# EAGLE design nucleum (EAGLE 6.5.0)
AUTHOR: Joshua Adkins; REV: A; TITLE: Nucleum

## Sheet 1 of 2
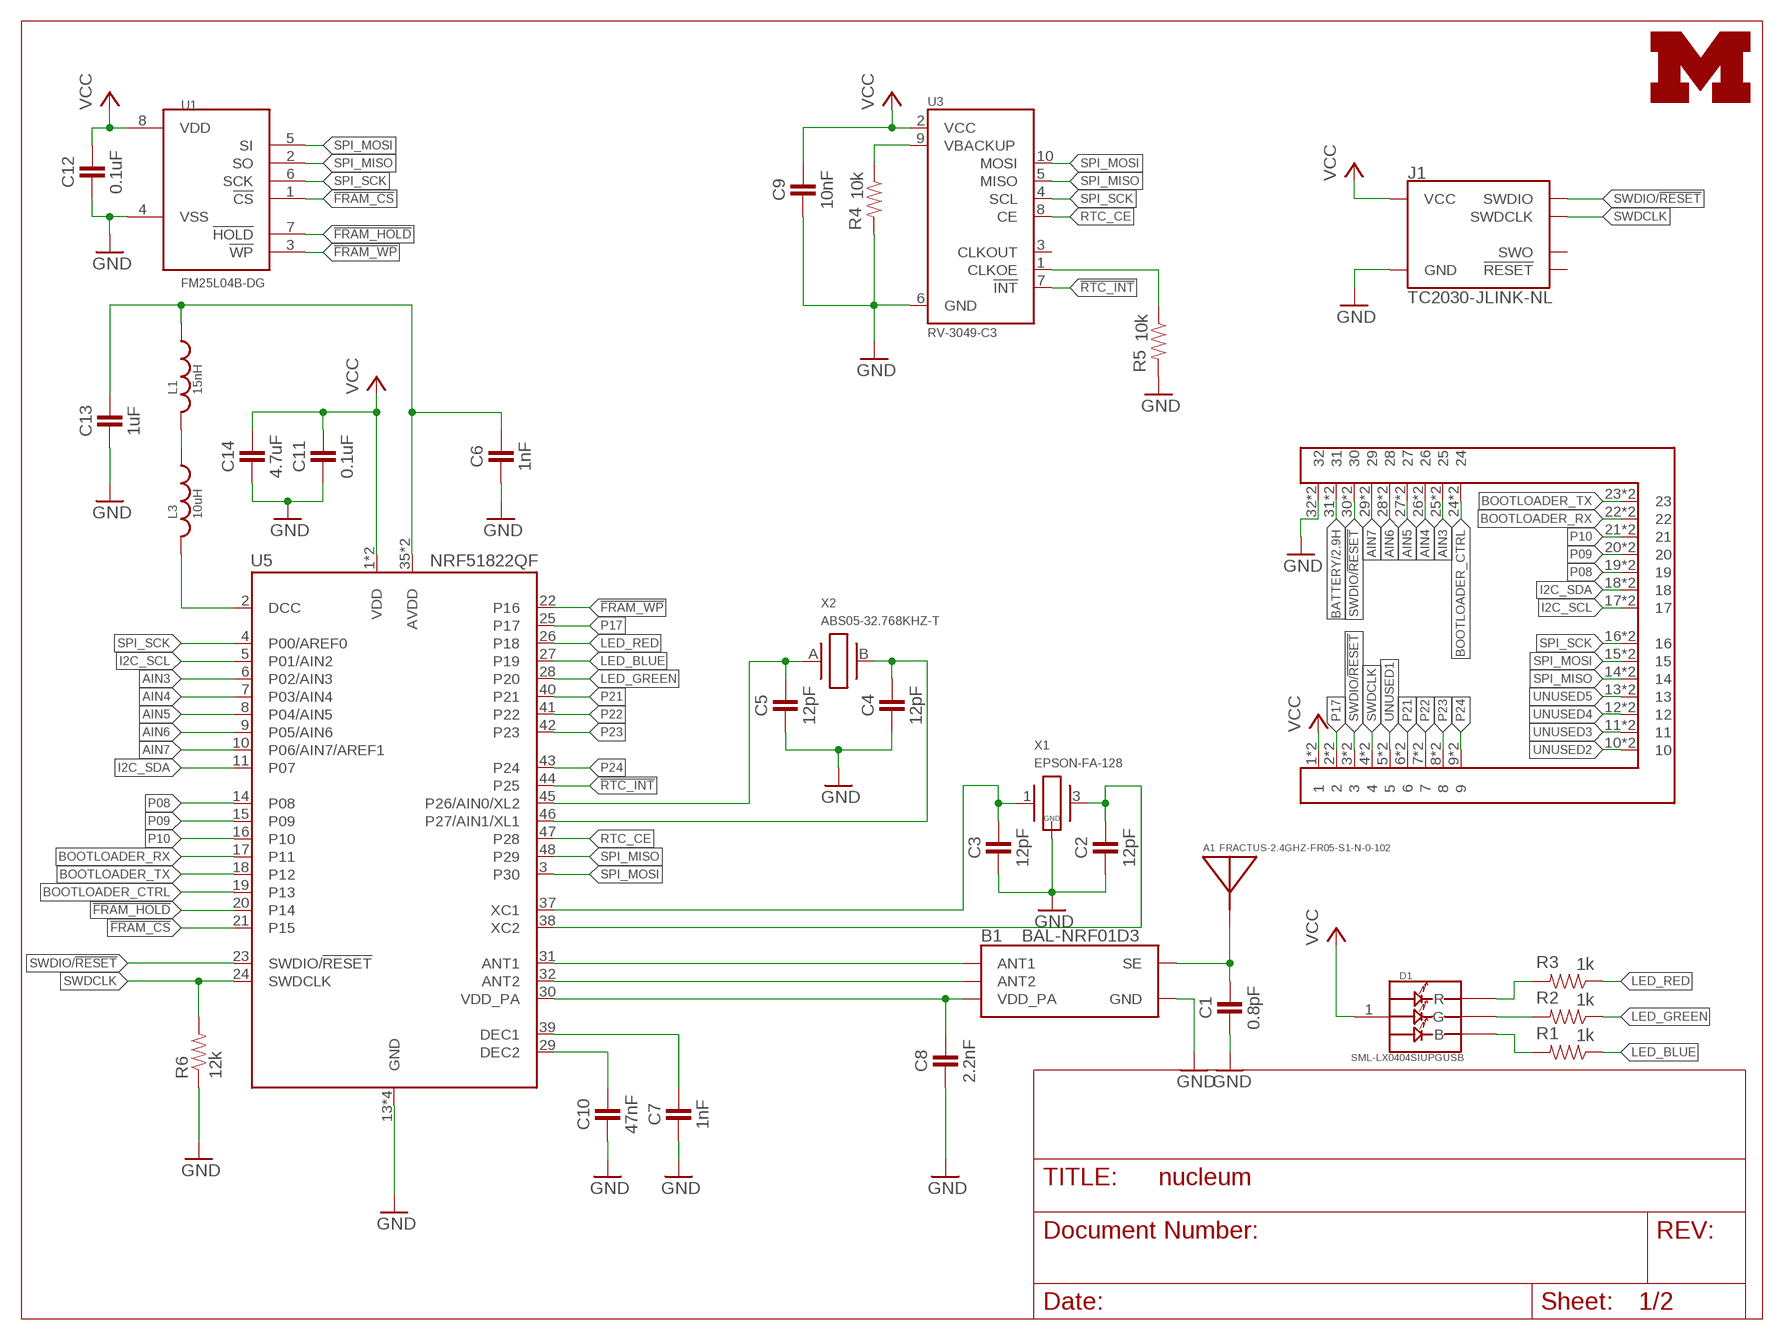
[diagram p0: schematic, sheet 1]

### Parts
A1  FRACTUS-2.4GHZ-FR05-S1-N-0-102  [FRACTUS-ANTENNA-FR05-S1-N-0-102]
B1  BAL-NRF01D3  [BAL-NRF01D3]
C1  0.8pF  CAPACITOR  [0402_CAP]
C2  12pF  CAPACITOR  [0402_CAP]
C3  12pF  CAPACITOR  [0402_CAP]
C4  12pF  CAPACITOR  [0402_CAP]
C5  12pF  CAPACITOR  [0402_CAP]
C6  1nF  CAPACITOR  [0402_CAP]
C7  1nF  CAPACITOR  [0402_CAP]
C8  2.2nF  CAPACITOR  [0402_CAP]
C9  10nF  CAPACITOR  [0402_CAP]
C10  47nF  CAPACITOR  [0402_CAP]
C11  0.1uF  CAPACITOR  [0402_CAP]
C12  0.1uF  CAPACITOR  [0402_CAP]
C13  1uF  CAPACITOR  [0402_CAP]
C14  4.7uF  CAPACITOR  [0402_CAP]
D1  SML-LX0404SIUPGUSB  [1MM_SQ_4PAD]
J1  TC2030-JLINK-NL  [TC2030-IDC-NL]
J3  ATUM-HEADER  [ATUM-HEADER]
L1  15nH  INDUCTOR0402  [0402_CAP]
L3  10uH  INDUCTOR0603  [0603_CAP]
LOGO1  UMICH_SOLID_TINY  [UMICH_SOLID_50MIL]
R1  1k  RESISTOR0402_RES  [0402_RES]
R2  1k  RESISTOR0402_RES  [0402_RES]
R3  1k  RESISTOR0402_RES  [0402_RES]
R4  10k  RESISTOR0402_RES  [0402_RES]
R5  10k  RESISTOR0402_RES  [0402_RES]
R6  12k  RESISTOR0402_RES  [0402_RES]
U1  FM25L04B-DG  [TDFN-8]
U3  RV-3049-C3  [MICRO-CRYSTAL-C3]
U5  NRF51822QF  [QFN-48-6MM]
X1  EPSON-FA-128  [FA-128]
X2  ABS05-32.768KHZ-T  [ABS05]

### Nets
!FRAM_CS: U1.1(!CS) U5.21(P15)
!FRAM_HOLD: U1.7(!HOLD) U5.20(P14)
!FRAM_WP: U1.3(!WP) U5.22(P16)
!RTC_INT: U3.7(!INT) U5.44(P25)
AIN3: J3.25 J3.25B U5.6(P02/AIN3)
AIN4: J3.26 J3.26B U5.7(P03/AIN4)
AIN5: J3.27 J3.27B U5.8(P04/AIN5)
AIN6: J3.28 J3.28B U5.9(P05/AIN6)
AIN7: J3.29 J3.29B U5.10(P06/AIN7/AREF1)
ANTENNA: A1.1(ANTENNA) B1.SE C1.1
BATTERY: J3.31 J3.31B ; also sheet 2
BOOTLOADER_CTRL: J3.24 J3.24B U5.19(P13)
BOOTLOADER_RX: J3.22 J3.22B U5.17(P11)
BOOTLOADER_TX: J3.23 J3.23B U5.18(P12)
GND: B1.GND C1.2 C2.2 C3.2 C4.2 C5.2 C6.2 C7.2 C8.2 C9.2 C10.2 C11.2 C12.2 C13.2 C14.2 J1.5(GND) J3.32 J3.32B R4.2 R5.2 R6.1 U1.4(VSS) U3.6(GND) U5.13(GND) U5.33(GND) U5.34(GND) U5.GND X1.2(GND) X1.4(GND) ; also sheet 2
I2C_SCL: J3.17 J3.17B U5.5(P01/AIN2)
I2C_SDA: J3.18 J3.18B U5.11(P07)
LED_BLUE: R1.1 U5.27(P19)
LED_GREEN: R2.1 U5.28(P20)
LED_RED: R3.1 U5.26(P18)
N$6: C5.1 U5.45(P26/AIN0/XL2) X2.A
N$7: D1.2(R) R3.2
N$9: C3.1 U5.37(XC1) X1.1
N$10: C2.1 U5.38(XC2) X1.3
N$11: D1.4(G) R2.2
N$12: D1.3(B) R1.2
N$13: C4.1 U5.46(P27/AIN1/XL1) X2.B
N$14: R4.1 U3.9(VBACKUP)
N$15: C10.1 U5.29(DEC2)
N$16: R5.1 U3.1(CLKOE)
N$17: C7.1 U5.39(DEC1)
N$18: B1.ANT1 U5.31(ANT1)
N$19: B1.ANT2 U5.32(ANT2)
N$20: B1.VCC(VDD_PA) C8.1 U5.30(VDD_PA)
N$36: C6.1 C13.1 L1.1 U5.35(AVDD) U5.36(AVDD)
N$37: L1.2 L3.1
N$38: L3.2 U5.2(DCC)
P08: J3.19 J3.19B U5.14(P08)
P09: J3.20 J3.20B U5.15(P09)
P10: J3.21 J3.21B U5.16(P10)
P17: J3.2 J3.2B U5.25(P17)
P21: J3.6 J3.6B U5.40(P21)
P22: J3.7 J3.7B U5.41(P22)
P23: J3.8 J3.8B U5.42(P23)
P24: J3.9 J3.9B U5.43(P24)
RTC_CE: U3.8(CE) U5.47(P28)
SPI_MISO: J3.14 J3.14B U1.2(SO) U3.5(MISO) U5.48(P29)
SPI_MOSI: J3.15 J3.15B U1.5(SI) U3.10(MOSI) U5.3(P30)
SPI_SCK: J3.16 J3.16B U1.6(SCK) U3.4(SCL) U5.4(P00/AREF0)
SWDCLK: J1.4(SWDCLK) J3.4 J3.4B R6.2 U5.24(SWDCLK)
SWDIO/!RESET: J1.2(SWDIO) J3.3 J3.3B J3.30 J3.30B U5.23(SWDIO/!RESET)
UNUSED1: J3.5 J3.5B
UNUSED2: J3.10 J3.10B
UNUSED3: J3.11 J3.11B
UNUSED4: J3.12 J3.12B
UNUSED5: J3.13 J3.13B
VCC: C9.1 C11.1 C12.1 C14.1 D1.1(VDD) J1.1(VCC) J3.1 J3.1B U1.8(VDD) U3.2(VCC) U5.1(VDD) U5.12(VDD) ; also sheet 2
Unconnected: J1.3(!RESET) J1.6(SWO) U3.3(CLKOUT)

## Sheet 2 of 2
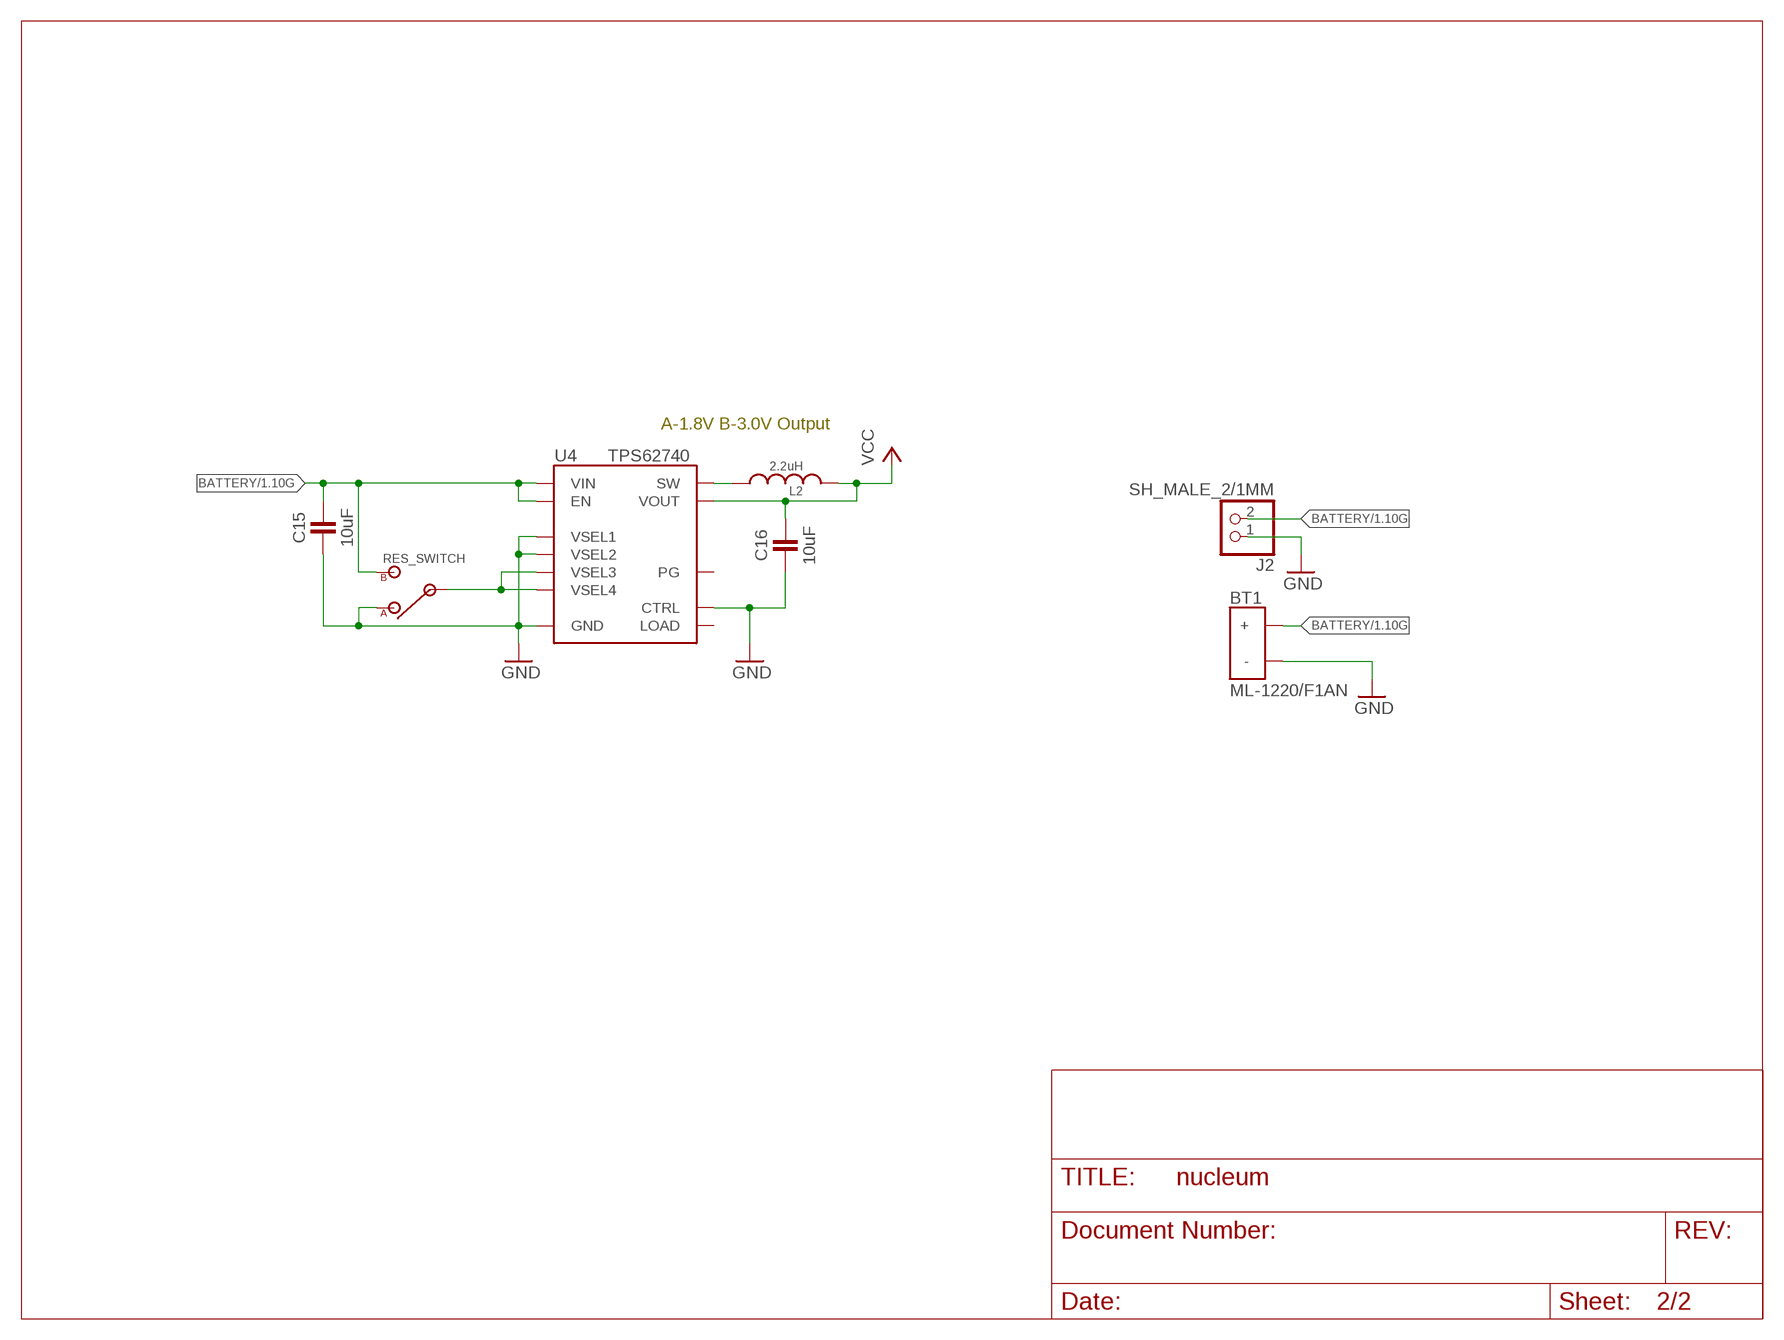
[diagram p1: schematic, sheet 2]

### Parts
BT1  ML-1220/F1AN  [ML-1220/F1BN]
C15  10uF  CAPACITOR0603_CAP  [0603_CAP]
C16  10uF  CAPACITOR0603_CAP  [0603_CAP]
J2  SH_MALE_2/1MM  [SH-1X2/1MM]
L2  2.2uH  MIPSZ2012D  [MIPSZ201D]
S1  RES_SWITCH  [RES_SWITCH]
U4  TPS62740  [R-PWSON-12]

### Nets
BATTERY: BT1.POS(+) C15.1 J2.2 S1.B U4.1(VIN) U4.12(EN) ; also sheet 1
GND: BT1.NEG(-) C15.2 C16.2 J2.1 S1.A U4.3(GND) U4.4(CTRL) U4.10(VSEL2) U4.11(VSEL1) U4.NC(GND) ; also sheet 1
N$5: L2.1 U4.2(SW)
N$8: S1.C(IN) U4.8(VSEL4) U4.9(VSEL3)
VCC: C16.1 L2.2 U4.5(VOUT) ; also sheet 1
Unconnected: U4.6(LOAD) U4.7(PG)

### Notes on the sheet
- A-1.8V B-3.0V Output

## Library data of the parts
A1 = chips:FRACTUS-2.4GHZ-FR05-S1-N-0-102: Fractus Compact Reach XtendTM chip antenna is engineered specifically for Bluetooth, WLAN 802.11 b/g/n and other wireless devices operating at the ISM 2.4 GHz band. Compact Reach Xtend combines small form factor size and high performance to improve the functionality of your wireless devices.; RICHARDSON_RFPD: FR05-S1-N-0102B
B1 = chips:BAL-NRF01D3: 50 ohm nominal input / conjugate match balun to nRF51422-QFAA, nRF24LE1, nRF51822-QFAA/AB, with integrated harmonic filter; DIGIKEY: 497-13637-1-ND; MOUSER: 511-BAL-NRF01D3
BT1 = batteries:ML-1220/F1AN: BATTERY LITH 3V RECHARGE PC PINS; DIGIKEY: P663-nd; MOUSER: 658-ML-1220/F1BN
C1-C14 = passives:CAPACITOR: 0402 Capacitor
C15 C16 = passives:CAPACITOR: 0402 Capacitor; DIGIKEY: 490-7316-1-ND
D1 = leds:SML-LX0404SIUPGUSB: 1mm^2 RGB LED; DIGIKEY: 67-2125-1-ND
J1 = connector:TC2030-JLINK
J2 = headers:SH_MALE_2/1MM: 1.0mm pitch/Disconnectable Crimp style connectors; DIGIKEY: 455-1788-2-ND
J3 = atum:ATUM-HEADER: Castellated header for the Atum board.
L1 L3 = passives:INDUCTOR
L2 = passives:MIPSZ2012D: FDK Multi-layer Power Inductor : MIPSZ2012D series (Very Small Type)
LOGO1 = logos:UMICH_SOLID
R1-R6 = passives:RESISTOR: Resistor Basic schematic elements and footprints for 0603, 1206, and PTH resistors.
S1 = switches:RES_SWITCH: 0402 Static Resistor Selector
U1 = chips:FM25: Cypress FRAM; DIGIKEY: FM25L04B-DGRA-ND; MOUSER: 877-FM25L04B-DG
U3 = chips:RV-3049-C3: The RV-3049-C3 is an ultra miniature Real-Time-Clock Module with embedded Crystal. This RTC has an SPI Bus (4-wire Serial- Interface) and offers temperature compensated time.
U4 = chips:TPS62740: 360nA Step Down Converter for Low Power Applications; DIGIKEY: 296-37134-1-ND; MOUSER: 595-TPS62740DSST; NEWARK: 27X9745
U5 = chips:NRF51822: Multiprotocol Bluetooth® 4.0 low energy/2.4 GHz RF SoC; DIGIKEY: 1490-1032-1-ND; MOUSER: 949-NRF51822-QFAB-R7
X1 = crystals:EPSON-FA-128: MHz RANGE CRYSTAL UNIT ULTRA MINIATURE SIZE LOW PROFILE SMD http://www.digikey.com/product-search/en?FV=ffec63d1
X2 = crystals:ABS05-32.768KHZ: 32.768kHz Crystal; DIGIKEY: 535-11899-1-ND

## Board
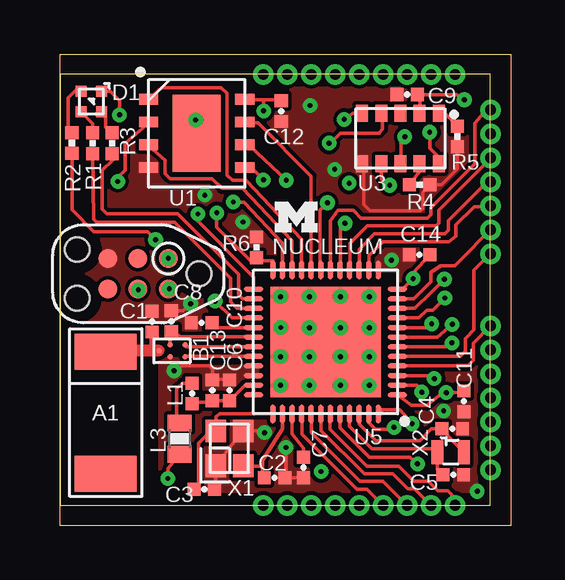
[diagram p2: board, top side]
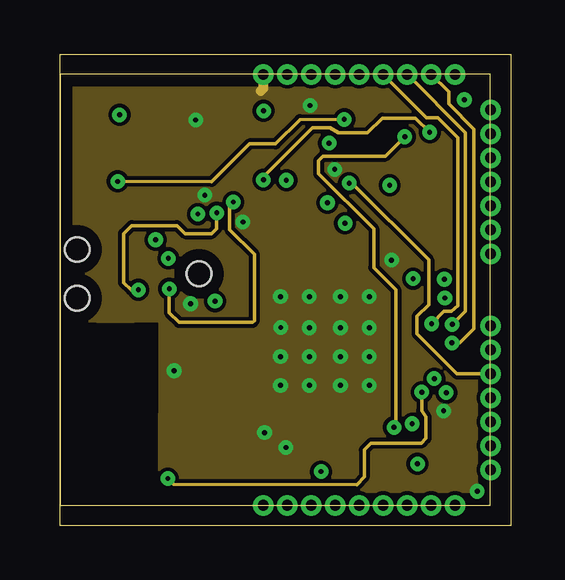
[diagram p3: board, inner layer Route2]
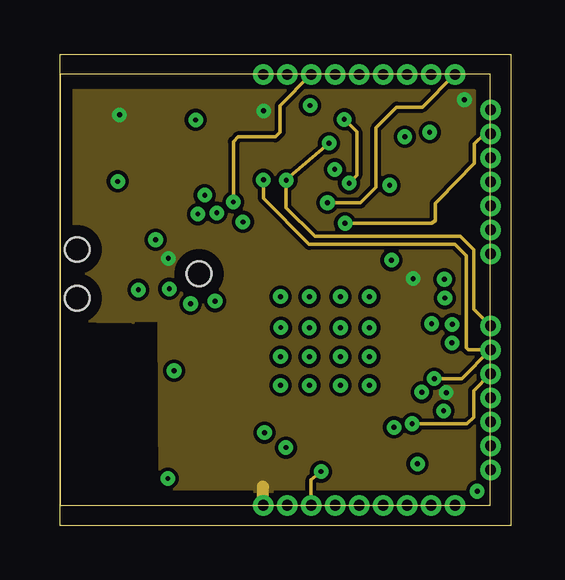
[diagram p4: board, inner layer Route15]
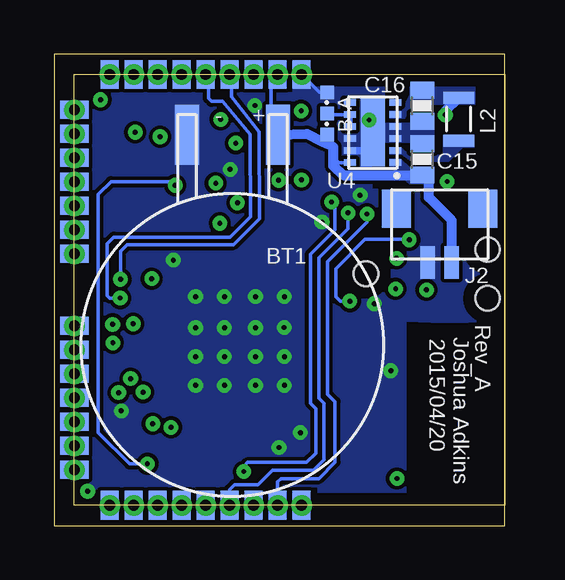
[diagram p5: board, bottom side, seen from below]

Size 17.96 x 17.96 mm. Coordinates in mm from the lower left corner, seen from the top.
Outline: 0,0 17.96,0 17.96,17.96 0,17.96 0,0
Copper layers (1+2*15+16): Top 0.0178mm / dielectric 12mil / Route2 0.0356mm / dielectric 28mil / Route15 0.0356mm / dielectric 12mil / Bottom 0.0178mm
Design rules "sunstone-4lyr_v1.0.0.3 *": minimum track width 6mil, minimum drill 8mil, track to track 6mil, track to pad 6mil, pad to pad 6mil, via to via 6mil, smd to smd 6mil, copper to edge 20mil, drill to drill 16mil, minimum pad ring 8mil, minimum via ring 8mil, stop-mask expansion 3mil, vias tented up to drill 10mil, thermal gap 10mil
Milling: 4 lines

### Footprints (pad centres in the part's own frame; a part is rotated, then mirrored left to right if it is on the bottom)
FRACTUS-ANTENNA-FR05-S1-N-0-102 = smd 1.5 x 2.6: 1 -2.55,0; 2 2.55,0
BAL-NRF01D3 = smd 0.22 x 0.22: ANT1 -0.537,-0.25; ANT2 -0.537,0.25; GND 0.069,0.25; SE 0.537,0; VCC 0.069,-0.25
ML-1220/F1BN = smd 2.5 x 1: NEG 8.75,1.9; POS 8.75,-1.9
0402_CAP = smd 0.536 x 0.546: 1 -0.433,0; 2 0.433,0
0603_CAP = smd 0.7 x 1: 1 -0.65,0; 2 0.65,0
1MM_SQ_4PAD = smd 0.457 x 0.457: 1 0.432,0.432; 2 0.432,-0.432; 3 -0.432,-0.432; 4 -0.432,0.432
TC2030-IDC-NL = smd 0.787 x 0.787: 1 -1.27,-0.635; 2 -1.27,0.635; 3 0,-0.635; 4 0,0.635; 5 1.27,-0.635; 6 1.27,0.635 | hole 1.016: -2.54,0; 2.54,1.016; 2.54,-1.016
SH-1X2/1MM = smd 0.6 x 1.35: 1 -0.5,0.1; 2 0.5,0.1 | smd 1.2 x 1.6: SUPPORT1 -1.8,2.335; SUPPORT2 1.8,2.335
ATUM-HEADER = drill 0.45 pad 0.754: 1 -9.479,-8.979; 2 -8.479,-8.979; 3 -7.479,-8.979; 4 -6.479,-8.979; 5 -5.479,-8.979; 6 -4.479,-8.979; 7 -3.479,-8.979; 8 -2.479,-8.979; 9 -1.479,-8.979; 10 0,-7.5; 11 0,-6.5; 12 0,-5.5; 13 0,-4.5; 14 0,-3.5; 15 0,-2.5; 16 0,-1.5; 17 0,1.5; 18 0,2.5; 19 0,3.5; 20 0,4.5; 21 0,5.5; 22 0,6.5; 23 0,7.5; 24 -1.479,8.979; 25 -2.479,8.979; 26 -3.479,8.979; 27 -4.479,8.979; 28 -5.479,8.979; 29 -6.479,8.979; 30 -7.479,8.979; 31 -8.479,8.979; 32 -9.479,8.979 | smd 0.754 x 1.2 bottom: 1B -9.479,-8.979; 2B -8.479,-8.979; 3B -7.479,-8.979; 4B -6.479,-8.979; 5B -5.479,-8.979; 6B -4.479,-8.979; 7B -3.479,-8.979; 8B -2.479,-8.979; 9B -1.479,-8.979; 24B -1.479,8.979; 25B -2.479,8.979; 26B -3.479,8.979; 27B -4.479,8.979; 28B -5.479,8.979; 29B -6.479,8.979; 30B -7.479,8.979; 31B -8.479,8.979; 32B -9.479,8.979 | smd 1.2 x 0.754 bottom: 10B 0,-7.5; 11B 0,-6.5; 12B 0,-5.5; 13B 0,-4.5; 14B 0,-3.5; 15B 0,-2.5; 16B 0,-1.5; 17B 0,1.5; 18B 0,2.5; 19B 0,3.5; 20B 0,4.5; 21B 0,5.5; 22B 0,6.5; 23B 0,7.5
MIPSZ201D = smd 0.5 x 1.3: 1 -0.9,0; 2 0.9,0
0402_RES = smd 0.536 x 0.546: 1 -0.433,0; 2 0.433,0
RES_SWITCH = smd 0.56 x 0.56: A -0.88,0; B 0.88,0; C 0,0
TDFN-8 = smd 0.45 x 0.8: 1 -1.425,-2.007; 2 -0.475,-2.007; 3 0.475,-2.007; 4 1.425,-2.007; 5 1.425,2.007; 6 0.475,2.007; 7 -0.475,2.007; 8 -1.425,2.007 | smd 3.2 x 2: NC 0,0
MICRO-CRYSTAL-C3 = smd 0.5 x 0.7: 1 -1.6,-1.05; 2 -0.8,-1.05; 3 0,-1.05; 4 0.8,-1.05; 5 1.6,-1.05; 6 1.6,1.05; 7 0.8,1.05; 8 0,1.05; 9 -0.8,1.05; 10 -1.6,1.05
R-PWSON-12 = smd 0.28 x 0.5: 1 -1.25,-0.95; 2 -0.75,-0.95; 3 -0.25,-0.95; 4 0.25,-0.95; 5 0.75,-0.95; 6 1.25,-0.95; 7 1.25,0.95; 8 0.75,0.95; 9 0.25,0.95; 10 -0.25,0.95; 11 -0.75,0.95; 12 -1.25,0.95 | smd 2.8 x 1: NC 0,0
QFN-48-6MM = smd 0.8 x 0.203: 1 -3,2.2; 2 -3,1.8; 3 -3,1.4; 4 -3,1; 5 -3,0.6; 6 -3,0.2; 7 -3,-0.2; 8 -3,-0.6; 9 -3,-1; 10 -3,-1.4; 11 -3,-1.8; 12 -3,-2.2; 25 3,-2.2; 26 3,-1.8; 27 3,-1.4; 28 3,-1; 29 3,-0.6; 30 3,-0.2; 31 3,0.2; 32 3,0.6; 33 3,1; 34 3,1.4; 35 3,1.8; 36 3,2.2 | smd 0.203 x 0.8: 13 -2.2,-3; 14 -1.8,-3; 15 -1.4,-3; 16 -1,-3; 17 -0.6,-3; 18 -0.2,-3; 19 0.2,-3; 20 0.6,-3; 21 1,-3; 22 1.4,-3; 23 1.8,-3; 24 2.2,-3; 37 2.2,3; 38 1.8,3; 39 1.4,3; 40 1,3; 41 0.6,3; 42 0.2,3; 43 -0.2,3; 44 -0.6,3; 45 -1,3; 46 -1.4,3; 47 -1.8,3; 48 -2.2,3 | smd 4.6 x 4.6: GND 0,0
FA-128 = smd 0.95 x 0.85: 1 -0.725,-0.575; 2 0.725,-0.575; 3 0.725,0.575; 4 -0.725,0.575
ABS05 = smd 0.5 x 1: A -0.55,0; B 0.55,0

### Placement (x,y rotation side)
A1  1.91,3.86 270 top
B1  4.67,6.44 180 top
BT1  11.36,6.69 90 bottom
C1  3.84,7.66 90 top
C2  8.95,1.15 0 top
C3  6.02,0.68 0 top
C4  16.36,3.2 0 top
C5  16.4,1.27 0 top
C6  7.07,4.79 90 top
C7  10.16,1.58 270 top
C8  4.65,7.67 90 top
C9  14.48,17.12 180 top
C10  5.91,7.62 180 top
C11  16.85,4.33 270 top
C12  9.23,16.43 270 top
C13  6.36,4.79 90 top
C14  15,10.44 180 top
C15  3.45,14.42 90 bottom
C16  3.45,16.65 270 bottom
D1  1.31,16.83 0 top
J1  3.26,9.65 180 top
J2  2.72,10.03 0 bottom
J3  17.96,8.98 0 top
L1  5.52,4.66 90 top
L2  1.93,16.09 90 bottom
L3  4.99,2.78 270 top
LOGO1  9.86,12.02 0 top
R1  1.36,15.09 90 top
R2  0.5,15.1 90 top
R3  2.17,15.09 90 top
R4  15,13.36 0 top
R5  16.58,15.37 270 top
R6  8.19,10.75 270 top
S1  7.41,16.33 270 bottom
U1  5.7,15.5 270 top
U3  14.2,15.29 180 top
U4  5.51,15.53 90 bottom
U5  11.08,6.81 180 top
X1  7.07,2.38 270 top
X2  16.29,2.22 0 top

### Tracks (layer width: path | path; a pad name or v marks a point on that pad's centre or on a via)
!FRAM_CS
  Top 0.152: 3.67,16.9 U1.1 4.23,17.41 6.72,17.41 6.96,17.17 6.96,13.75 7.2,13.54 7.76,13.54 10.08,11.08 U5.21
  Top 0.406: U1.1
!FRAM_HOLD
  Top 0.152: U5.20 10.48,13.72 8.25,15.95 7.63,15.95 7.68,15.95
  Top 0.406: 7.68,15.95 7.71,15.95 U1.7
!FRAM_WP
  Top 0.152: 3.67,15 4.39,14.37 4.39,13.82 4.6,13.61 6.35,13.61 6.76,13.21 7.62,13.21 9.68,11.02 U5.22
  Top 0.406: U1.3 3.67,15.03 3.67,15
!RTC_INT  (via drill 0.2)
  Top 0.152: U5.44 11.68,3.23 12.9,2 14.59,2 v14.91,1.73 | v13.75,13.34 13.4,13.6 U3.7
  Bottom 0.152: v13.75,13.34 13.82,13.49 16.43,13.49 16.96,12.96 16.96,3.03 15.66,1.73 v14.91,1.73
AIN3  (via drill 0.2)
  Top 0.152: U5.6 16.19,6.61 v16.35,6.77
  Route2 0.152: J3.25B 16.21,17.23 16.21,16.73 17.27,15.67 17.27,7.36 16.68,6.77 v16.35,6.77
AIN4  (via drill 0.2)
  Top 0.152: U5.7 15.75,7.01 v16.36,7.54
  Route2 0.152: v16.36,7.54 16.91,8.09 16.91,15.53 J3.26
AIN5  (via drill 0.2)
  Top 0.152: U5.8 15.34,7.41 v15.5,7.57
  Route2 0.152: J3.27 15.29,16.15 15.75,16.15 16.59,15.31 16.59,8.32 16.33,8.09 16.02,8.09 v15.5,7.57
AIN6  (via drill 0.2)
  Top 0.152: v16.05,8.64 15.55,8.14 15.3,8.14 14.97,7.81 U5.9
  Bottom 0.152: J3.28 12.37,17.85 12.37,16.96 12.24,16.83 11.78,16.83 10.63,15.47 10.62,12.02 11.46,11.18 16.31,11.18 16.58,10.91 16.58,8.73 16.49,8.64 v16.05,8.64
AIN7  (via drill 0.2)
  Top 0.152: v16.03,9.42 15.48,8.89 14.8,8.21 U5.10
  Bottom 0.152: J3.29 11.4,17.88 11.4,17.03 10.25,15.57 10.24,11.95 11.32,10.87 15.75,10.87 16.03,10.59 v16.03,9.42
ANTENNA
  Top 0.254: B1.SE 4.25,6.48 4.1,6.44 | C1.1 3.84,6.44
  Top 0.5: A1.1 3.11,6.44 3.84,6.44 4.1,6.44
BATTERY
  Bottom 0.152: U4.12 6.93,14.28 7.16,14.52 | BT1.POS 9.35,16.21 9.75,16.61 9.75,17.82 J3.31B
  Bottom 0.203: S1.B 7.39,15.34 7.59,15.14
  Bottom 0.406: BT1.POS 8.27,15.48 7.59,15.14 7.16,14.92 7.16,14.52 7.16,14.14 6.75,13.76 3.46,13.76 C15.1 3.18,13.49 3.18,12.83 2.22,11.87 J2.2
  pour Bottom (no thermals): 2.97,13.38 2.97,14.09 3.96,14.09 4.34,14.44 4.82,14.44 4.82,14.14 4.52,13.83 3.99,13.38
BOOTLOADER_CTRL  (via drill 0.2)
  Top 0.152: U5.19 10.85,9.83 10.85,12.3 v11.16,12.61
  Route15 0.152: v11.16,12.61 12.54,12.61 13.18,13.25 13.18,15.73 14.04,16.59 15.11,16.59 J3.24B
BOOTLOADER_RX  (via drill 0.2)
  Top 0.152: U5.17 11.69,11.55 v11.89,11.75
  Route15 0.152: J3.22 17.71,15.48 17.28,15.06 17.28,14.25 15.81,12.74 15.65,12.58 15.65,11.87 15.49,11.75 v11.89,11.75
BOOTLOADER_TX
  Top 0.152: J3.23B 17.77,16.48 17.29,15.92 17.29,14.24 15.46,12.41 15.46,12.12 15.32,11.97 12.55,11.97 12.24,12.29 12.22,12.29 11.6,12.29 11.28,11.86 U5.18
GND  (via drill 0.2)
  Top 0.152: R4.2 15.91,13.36 16.58,14.02 R5.2 | U3.6 12.68,14.16 12.68,12.52 12.92,12.28 15.04,12.28 15.13,12.37 15.13,13.05 R4.2 | 15.29,13.4 R4.2 | C6.2 7.03,5.26 6.96,5.26 6.36,5.25 | 6.36,5.25 C13.2 | v8.53,3.03 8.47,3.1 X1.4 X1.2 6.49,0.72 C3.2 | C8.2 5.13,8.1 v5.45,8.4 | 6.36,5.25 6.36,5.68 6.22,5.82 4.97,5.82 v4.76,5.61 | C7.2 C2.2 9.42,1.19 v9.42,2.41
  Top 0.406: U5.GND 11.7,6.81 v11.7,6.2
  Route2 0.406: J3.32 8.48,17.37 8.38,17.27
  Bottom 0.152: S1.A 7.73,17.21 J3.32
  Bottom 0.305: 5.76,15.78 U4.NC | 5.26,15.78 U4.NC | U4.11 5.83,14.78 5.51,15.1 U4.NC
  other vias: 11.46,14 17.4,0.59 16,3.94 7.63,11.81 13.83,10.22 10.43,16.66 9.2,8.7 10.4,8.7 12.9,8.7 11.7,8.7 11.7,7.4 10.4,5 9.2,5 10.4,6.2 9.2,6.2 10.4,7.4 9.21,7.41 12.9,7.4 12.9,6.2 12.9,5 11.7,5 6.04,12.93 5.66,16.06
  pour Top (no thermals): 0.02,17.99 17.94,17.93 17.96,0 4.18,0.02 4.19,6.11 4.98,6.12 5.01,5.75 8.24,5.82 8.24,3.8 14.2,3.83 14.21,9.78 8.5,9.77 8.45,6.99 4.2,7.01 4.2,7.7 3.48,7.67 3.05,7.67 3.05,7.64 0,7.69
  pour Bottom (no thermals): 5.08,18 8.79,17.96 8.79,17.14 17.14,17.14 17.27,0.71 7.75,0.81 7.75,0 4.17,0.02 4.16,7.72 3.05,7.68 3.05,7.64 0,7.69 0,17.98 1.01,18.02 1.01,13.12 5.59,13.12 5.59,16.8 5.08,16.8
  pour Route2 (no thermals): 0.02,17.99 8.1,17.92 8.13,18.47 8.81,18.47 8.85,17.93 17.93,17.92 17.94,0.01 4.15,0.03 4.18,7.68 3.06,7.69 3.06,7.65 3.06,7.64 0,7.69
  pour Bottom (no thermals): 2.94,15.94 5.59,15.94 5.59,15.1 2.94,15.1
I2C_SCL
  Top 0.152: U5.5 16.7,6.21 16.9,6.42 16.9,6.94 17.27,7.31 17.27,9.79 J3.17
I2C_SDA
  Top 0.152: J3.18 16.68,10.19 16.47,9.98 15.88,9.98 15.46,9.72 15.46,9.31 14.76,8.61 U5.11
LED_BLUE
  Top 0.152: 1.4,14.68 R1.1 1.4,11.93 1.54,11.79 4.78,11.79 7.11,9.46 7.11,8.49 7.39,8.21 U5.27
LED_GREEN  (via drill 0.2)
  Top 0.152: U5.28 7.17,7.81 v6.47,8.51 | R2.1 0.5,12.32 1.41,11.41 3.65,11.41 v3.99,11.07
  Bottom 0.152: v6.47,8.51 6.85,8.51 7.04,8.7 7.04,9.87 5.83,11.08 v4,11.08 v3.99,11.07
LED_RED
  Top 0.152: 2.18,14.69 R3.1 | R3.1 2.2,14.39 1.77,13.96 1.77,12.33 1.94,12.16 4.9,12.16 7.45,9.64 7.45,8.77 7.61,8.61 U5.26 | 2.2,14.69 R3.1
N$5
  pour Bottom (no thermals): 4.82,14.92 4.34,14.92 3.96,14.62 2.59,14.62 2.59,15.43 1.27,15.38 1.27,14.9 1.75,14.9 2.33,14.31 3.91,14.31 4.29,14.62 4.82,14.62
N$6
  Top 0.152: 15.86,2.3 X2.A | 15.63,2.36 X2.A | C5.1 15.74,1.49 X2.A | U5.45 12.08,3.3 13.02,2.36 15.61,2.36 X2.A
N$7
  Top 0.152: 1.77,16.25 D1.2 1.9,16.23 1.9,15.76 R3.2
N$8
  Bottom 0.152: U4.8 7.36,16.28 S1.C
  Bottom 0.203: U4.8 U4.9
N$9
  Top 0.152: U5.37 8.86,3.82 6.65,3.82 6.52,3.69 6.52,3.03 X1.1 6.31,3.1 5.79,2.58 5.79,0.88 C3.1
N$10
  Top 0.152: U5.38 9.29,3.77 9.28,3.2 8.44,1.89 8.44,1.64 | 8.44,1.64 8.44,1.15 C2.1 | X1.3 8.44,1.64
N$11
  Top 0.152: R2.2 0.34,15.77 0.34,16.98 0.66,17.3 D1.4
N$12
  Top 0.152: 0.92,16.26 D1.3 1.36,15.91 R1.2
N$13
  Top 0.152: 15.85,3.29 C4.1 | U5.46 12.48,3.87 12.48,3.39 13.17,2.7 15,2.7 15.5,3.2 C4.1 | X2.B 15.93,3.14 C4.1
N$14
  Top 0.152: R4.1 15,13.91 U3.9
N$15
  Top 0.152: U5.29 6.45,7.41 C10.1
N$16
  Top 0.152: U3.1 16.04,16.34 R5.1
N$17
  Top 0.152: U5.39 9.68,2.98 10.16,2.38 C7.1
N$18
  Top 0.152: B1.ANT1 5.26,6.62 8.24,6.62 U5.31
N$19
  Top 0.152: U5.32 5.29,6.21 B1.ANT2
N$20
  Top 0.152: B1.VCC 4.6,7.17 C8.1 4.79,7.22 5.01,7.03 8.23,7.03 U5.30
N$36
  Top 0.152: U5.36 U5.35 7.72,5.01 C6.1 6.54,4.36 6.41,4.36 6.38,4.39 C13.1 6.29,4.29 5.53,4.29 5.52,4.26 L1.1
N$37
  Top 0.152: L1.2 5.11,5.09 4.86,4.87 4.86,3.76 L3.1
N$38  (via drill 0.2)
  Top 0.152: U5.2 14.89,5.01 v15.09,4.72 | v4.5,1.12 4.51,1.54 L3.2
  Route2 0.152: v15.09,4.72 15.09,3.95 15.27,3.69 15.27,2.79 15.07,2.59 12.97,2.59 12.69,2.31 12.69,1.19 12.38,0.87 4.73,0.88 v4.5,1.12
P08
  Top 0.152: J3.19 17.93,12.45 17.27,12.45 16.51,11.68 16.51,11.21 16.22,10.99 13.47,10.99 12.89,10.41 U5.14
P09
  Top 0.152: U5.15 12.48,10.67 13.12,11.31 16.04,11.31 16.19,11.46 16.19,11.85 17.82,13.48 J3.20
P10
  Top 0.152: U5.16 12.1,9.78 12.1,10.93 12.83,11.66 15.7,11.66 15.8,11.76 15.8,12.31 17.95,14.45 J3.21
P17  (via drill 0.2)
  Top 0.152: v5.75,12.14 5.75,11.84 8.08,9.51 U5.25
  Bottom 0.152: J3.2B 9.48,0.98 9.34,1.12 7.76,1.12 7.08,1.8 7.08,4.32 7.4,4.64 7.4,10.15 5.75,11.8 v5.75,12.14
P21
  Top 0.152: U5.40 10.09,2.97 12.38,0.68 12.8,0.68 J3.6
P22
  Top 0.152: U5.41 10.49,3.9 10.49,3.02 12.51,1 13.48,1 J3.7
P23
  Top 0.152: U5.42 10.88,3.9 10.88,3.12 12.69,1.31 13.89,1.31 14.51,0.69 14.79,0.69 J3.8B
P24
  Top 0.152: 16.48,0.29 J3.9B 16.48,0.3 16.17,0.61 15.75,0.61 15.36,1 14.76,1 14.13,1.63 12.81,1.63 11.27,3.17 11.27,3.93 U5.43
RTC_CE  (via drill 0.2)
  Top 0.152: U3.8 14.21,14.25 14.21,15.19 v14.38,15.36 | U5.47 12.88,3.84 12.88,3.44 13.15,3.17 13.85,3.17 v13.93,3.25
  Route2 0.152: v13.93,3.25 14.01,3.33 14.01,8.99 13.09,9.91 13.09,11.53 10.79,13.81 10.79,14.37 10.97,14.55 13.57,14.55 v14.38,15.36
SPI_MISO  (via drill 0.2)
  Top 0.152: U3.5 12.22,16.34 v11.86,16.09 | v2.41,13.5 2.41,13.67 2.71,13.97 2.72,15.09 3.73,15.96 3.73,15.95 3.67,15.95 | U5.48 13.43,3.81 13.43,3.98 14.18,3.98 v14.69,3.4
  Top 0.406: U1.2 3.73,15.97 3.73,15.96
  Route2 0.152: v2.41,13.5 6.33,13.49 7.9,15.06 9,15.06 10.01,16.07 11.61,16.08 v11.86,16.09 | v12.06,13.43 12.18,13.43 15.38,10.23 15.38,8.37 14.89,7.88 14.89,7.15 16.56,5.48 J3.14B
  Route15 0.152: v14.69,3.4 16.96,3.4 17.26,3.67 17.26,4.78 J3.14B | v11.86,16.09 12.38,15.56 12.38,13.75 v12.06,13.43
SPI_MOSI  (via drill 0.2)
  Top 0.152: 7.68,14.05 7.9,14.04 | 7.93,14.04 7.68,14.05 | v8.48,13.56 8,14.04 7.68,14.05 | U3.10 15.8,14.5 15.42,14.88 v15.42,15.54 | U5.3 15.49,5.41 v15.61,5.28
  Top 0.406: U1.5 7.68,14.07 7.68,14.05
  Route2 0.152: v8.48,13.56 8.48,13.68 10.53,15.73 11.27,15.73 11.61,15.52 12.82,15.52 13.44,16.14 14.82,16.14 v15.42,15.54
  Route15 0.152: v8.48,13.56 8.48,12.8 10.39,10.88 16.47,10.88 16.94,10.41 16.94,6.56 17.02,6.48 J3.15B 16.76,5.28 v15.61,5.28
SPI_SCK  (via drill 0.2)
  Top 0.152: 7.87,14.99 7.68,15 7.9,14.99 v9.44,13.55 | v11.22,15.1 11.27,15.1 11.69,15.52 13.32,15.52 13.45,15.67 13.45,16.28 U3.4 | U5.4 14.24,5.82 14.39,5.82 17.01,5.82 17.23,6.05 17.23,6.75 J3.16
  Top 0.406: 7.68,15 7.71,15 U1.6
  Route15 0.152: v11.22,15.1 9.44,13.57 v9.44,13.55 9.41,13.54 9.43,13.5 9.43,12.41 10.63,11.21 16.7,11.21 17.26,10.65 17.26,8.18 J3.16
SWDCLK  (via drill 0.2)
  Top 0.152: U5.24 8.88,10.19 8.86,10.2 8.35,10.2 R6.2 | R6.2 8.33,10.27 | v6.54,12.19 6.54,11.59 7.73,10.4 7.92,10.22 R6.2 | J1.4 v3.26,8.99 v3.27,8.98
  Route2 0.152: v3.27,8.98 2.96,8.98 2.65,9.28 2.65,11.32 2.99,11.66 4.88,11.66 5.22,11.32 6.33,11.32 6.54,11.53 v6.54,12.19
  Bottom 0.152: v6.54,12.19 6.54,11.53 7.75,10.32 7.75,4.46 7.55,4.26 7.55,1.9 7.99,1.46 9.7,1.46 10.29,0.87 11.28,0.87 11.49,0.66 J3.4
SWDIO/!RESET  (via drill 0.2)
  Top 0.152: U5.23 9.28,10.92 7.67,12.64 v7.23,12.64 | J1.2 v4.55,9.02 v4.56,9.02
  Route2 0.152: v4.56,9.02 4.56,8.03 4.96,7.63 8.04,7.63 8.11,7.7 8.11,10.46 7.08,11.49 7.08,12.49 v7.23,12.64
  Route15 0.152: J3.3B 10.48,1.07 v10.89,1.41 | J3.30 9.18,16.66 9.18,15.55 8.98,15.35 7.42,15.35 7.23,15.16 v7.23,12.64
  Bottom 0.152: 7.25,12.62 v7.23,12.64 7.08,12.49 7.08,11.49 8.11,10.46 8.11,4.26 7.88,4.03 7.88,2.18 8.27,1.79 10.73,1.79 10.86,1.66 v10.89,1.41
VCC  (via drill 0.2)
  Top 0.152: U3.2 15.01,16.35 15.01,17.07 C9.1 | C9.1 15.06,17.2 | C9.1 15.14,17.12 16.55,17.12 v16.86,16.9 | D1.1 2.09,17.26 2.48,16.87 v2.48,16.27 | 7.68,16.9 8.08,16.89 8.45,16.89 | 8.45,16.89 9.02,16.89 9.14,17.02 9.14,16.97 C12.1 | C11.1 16.76,4.68 16.67,4.71 v16.11,4.7 15.96,4.69 15.31,4.17 14.67,4.17 U5.1 | U5.12 14.29,9.01 v14.73,9.45 14.73,9.68 C14.1 | v8.5,16.44 8.5,16.87 8.45,16.89 | J1.1 v4.52,10.29
  Top 0.406: 7.68,16.9 7.71,16.9 U1.8
  Route15 0.152: v4.52,10.29 J1.1
  Route15 0.508: J3.1B 8.48,0.77 8.46,0.79
  Bottom 0.406: v2.48,16.27 2.48,16.44 L2.2
  pour Route15 (no thermals): 0,17.27 17.27,17.27 17.3,6.47 17.3,6.33 17.27,0.69 8.84,0.69 8.84,-0.51 8.13,-0.51 8.13,0.69 4.17,0.68 4.14,7.7 3.04,7.69 3.05,7.61 3.05,7.64 0,7.69
  pour Bottom (no thermals): 4.82,16.12 4.16,16.12 3.83,16.7 1.24,16.7 1.24,17.74 3.99,17.74 3.99,17.11 4.29,16.45 4.82,16.45

### Text on the board
tPlace: NUCLEUM
bPlace: + | - | Rev_A | 2015/04/20 | Joshua Adkins